# Altium schematic sheet WateringMachine.SchDoc
size A4
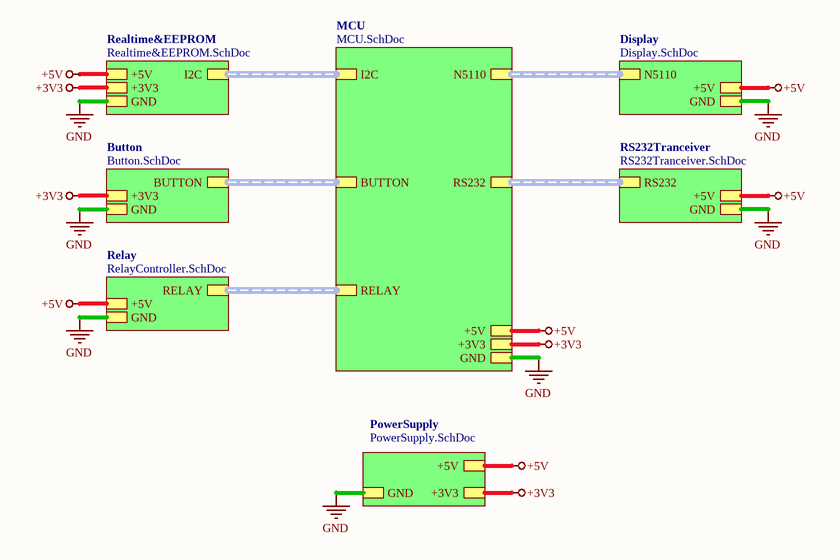
[diagram p0: WateringMachine.SchDoc]

## Sub-sheets
Button = Button.SchDoc: +3V3, GND, BUTTON (harness BUTTON)
Display = Display.SchDoc: +5V, GND, N5110 (harness N5110LCD)
MCU = MCU.SchDoc: N5110 (harness N5110LCD), GND, +3V3, RS232 (harness RS232), I2C (harness I2C), BUTTON (harness BUTTON), RELAY (harness RELAY), +5V
PowerSupply = PowerSupply.SchDoc: +5V, GND, +3V3
Realtime&EEPROM = Realtime&EEPROM.SchDoc: +5V, GND, I2C (harness I2C), +3V3
Relay = RelayController.SchDoc: +5V, GND, RELAY (harness RELAY)
RS232Tranceiver = RS232Tranceiver.SchDoc: +5V, GND, RS232 (harness RS232)

## Nets
+3V3: sheet PowerSupply/+3V3, sheet MCU/+3V3, sheet Realtime&EEPROM/+3V3, sheet Button/+3V3
+5V: sheet PowerSupply/+5V, sheet MCU/+5V, sheet Display/+5V, sheet RS232Tranceiver/+5V, sheet Realtime&EEPROM/+5V, sheet Relay/+5V
GND: sheet PowerSupply/GND, sheet MCU/GND, sheet Display/GND, sheet RS232Tranceiver/GND, sheet Realtime&EEPROM/GND, sheet Button/GND, sheet Relay/GND

## Buses and harness runs
harness sheet Button/BUTTON = sheet MCU/BUTTON
harness sheet Display/N5110 = sheet MCU/N5110
harness sheet MCU/I2C = sheet Realtime&EEPROM/I2C
harness sheet MCU/RELAY = sheet Relay/RELAY
harness sheet MCU/RS232 = sheet RS232Tranceiver/RS232